# EAGLE design transponder (EAGLE 5.07)
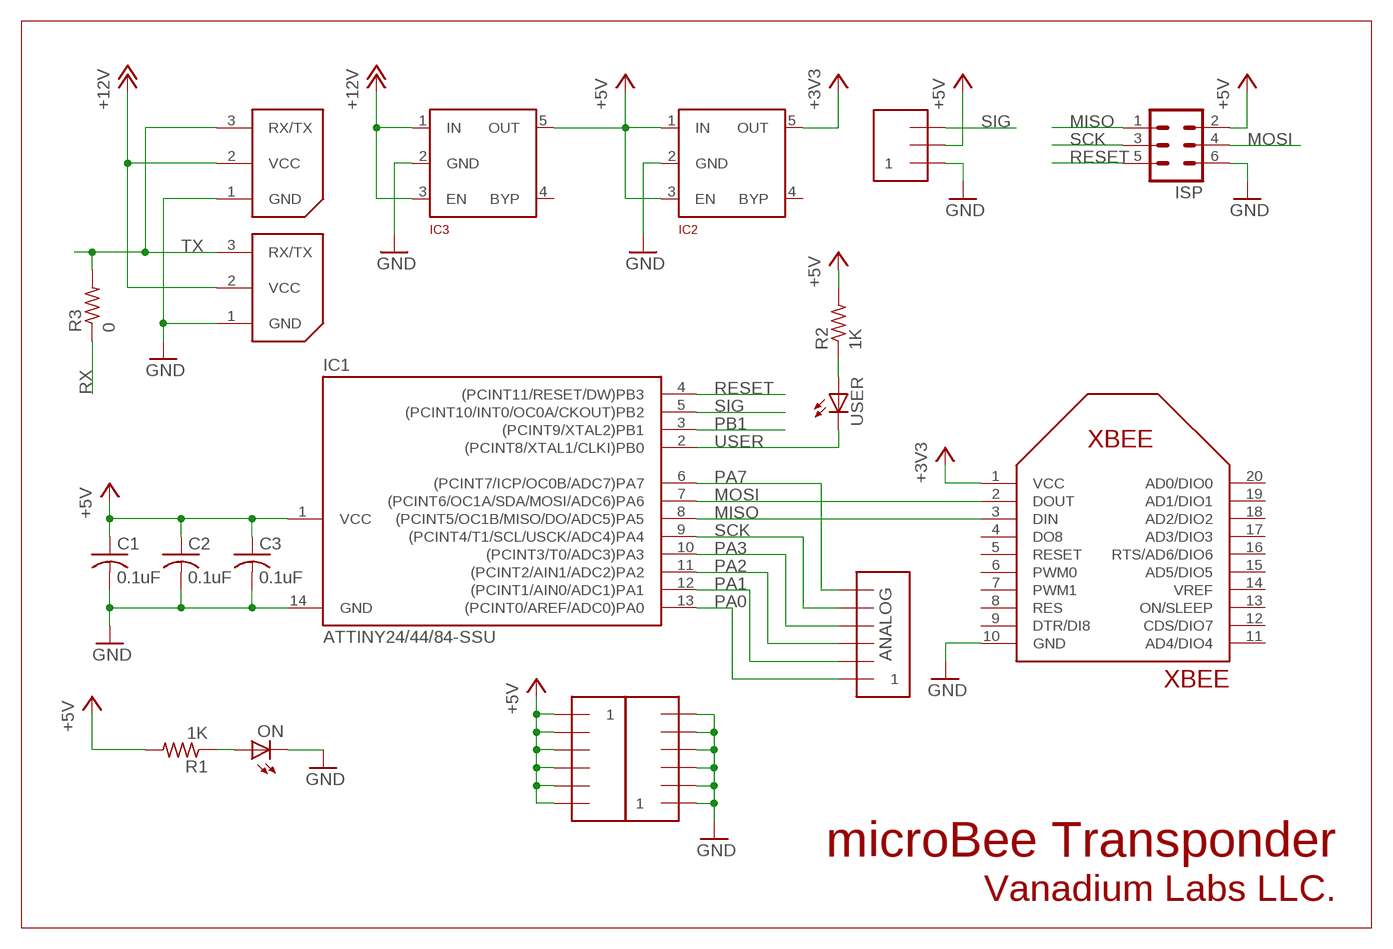
[diagram p0: schematic, sheet 1]

## Parts
C1  0.1uF  C-USC0603  [C0603]
C2  0.1uF  C-USC0603  [C0603]
C3  0.1uF  C-USC0603  [C0603]
IC1  ATTINY24/44/84-SSU  [SOIC14]
IC2  MIC5205-3.3  [SOT-23-5]
IC3  MIC5205-5.0  MIC5205-3.3  [SOT-23-5]
ISP  MA03-2  [MA03-2]
ON  LEDCHIPLED_0603  [CHIPLED_0603]
R1  1K  R-US_R0603  [R0603]
R2  1K  R-US_R0603  [R0603]
R3  0  R-US_R0603  [R0603]
U$1  AX-12  [WM18887-ND]
U$2  HEADER6  [1X6]
U$3  HEADER2X6  [2X6]
U$4  HEADER3  [1X3]
U$5  AX-12  [WM18887-ND]
USER  LEDCHIPLED_0603  [CHIPLED_0603]
XBEE  XBEE  [XBEE]

## Nets
+3V3: IC2.5(OUT) XBEE.1(VCC)
+5V: C1.1 C2.1 C3.1 IC1.1(VCC) IC2.1(IN) IC2.3(EN) IC3.5(OUT) ISP.2 R1.2 R2.2 U$3.P$7 U$3.P$8 U$3.P$9 U$3.P$10 U$3.P$11 U$3.P$12 U$4.P$2
+12V: IC3.1(IN) IC3.3(EN) U$1.2(VCC) U$5.2(VCC)
GND: C1.2 C2.2 C3.2 IC1.14(GND) IC2.2(GND) IC3.2(GND) ISP.6 ON.C U$1.1(GND) U$3.P$1 U$3.P$2 U$3.P$3 U$3.P$4 U$3.P$5 U$3.P$6 U$4.P$1 U$5.1(GND) XBEE.10(GND)
MISO: IC1.8((PCINT5/OC1B/MISO/DO/ADC5)PA5) ISP.1 R3.2 U$1.3(RX/TX) U$5.3(RX/TX) XBEE.3(DIN)
MOSI: IC1.7((PCINT6/OC1A/SDA/MOSI/ADC6)PA6) ISP.4 R3.1 XBEE.2(DOUT)
N$13: ON.A R1.1
N$14: R2.1 USER.A
PA0: IC1.13((PCINT0/AREF/ADC0)PA0) U$2.P$1
PA1: IC1.12((PCINT1/AIN0/ADC1)PA1) U$2.P$2
PA2: IC1.11((PCINT2/AIN1/ADC2)PA2) U$2.P$3
PA3: IC1.10((PCINT3/T0/ADC3)PA3) U$2.P$4
PA7: IC1.6((PCINT7/ICP/OC0B/ADC7)PA7) U$2.P$6
PB1: IC1.3((PCINT9/XTAL2)PB1)
RESET: IC1.4((PCINT11/RESET/DW)PB3) ISP.5
SCK: IC1.9((PCINT4/T1/SCL/USCK/ADC4)PA4) ISP.3 U$2.P$5
SIG: IC1.5((PCINT10/INT0/OC0A/CKOUT)PB2) U$4.P$3
USER: IC1.2((PCINT8/XTAL1/CLKI)PB0) USER.C
Unconnected: IC2.4(BYP) IC3.4(BYP) XBEE.4(DO8) XBEE.5(RESET) XBEE.6(PWM0) XBEE.7(PWM1) XBEE.8(RES) XBEE.9(DTR/DI8) XBEE.11(AD4/DIO4) XBEE.12(CDS/DIO7) XBEE.13(ON/SLEEP) XBEE.14(VREF) XBEE.15(AD5/DIO5) XBEE.16(RTS/AD6/DIO6) XBEE.17(AD3/DIO3) XBEE.18(AD2/DIO2) XBEE.19(AD1/DIO1) XBEE.20(AD0/DIO0)

## Notes on the sheet
- TX
- RX
- ANALOG
- microBee Transponder
- Vanadium Labs LLC.

## Library data of the parts
C1-C3 = rcl:C-US: CAPACITOR, American symbol
IC1 = attiny24_44_84:ATTINY24/44/84
IC2 IC3 = robots:MIC5205-3.3
ISP = con-lstb:MA03-2: PIN HEADER
ON USER = led:LED: LED OSRAM: - CHIPLED LG R971, LG N971, LY N971, LG Q971, LY Q971, LO R971, LY R971 LH N974, LH R974 LS Q976, LO Q976, LY Q976 LO Q996 - Hyper CHIPLED LW Q18S LB Q993, LB Q99A, LB R99A - SideLED LS A670, LO A670, LY A670, LG A670, LP A670 LB A673, LV A673, LT A673, LW A673 LH A674 LY A675 LS A676, LA A676, LO A676, LY A676, LW A676 LS A679, LY A679, LG A679 - Hyper Micro SIDELED® LS Y876, LA Y876, LO Y876, LY Y876 LT Y87S - SmartLED LW L88C, LW L88S LB L89C, LB L89S, LG L890 LS L89K, LO L89K, LY L89K LS L896, LA L896, LO L896, LY L896 - TOPLED LS T670, LO T670, LY T670, LG T670, LP T670 LSG T670, LSP T670, LSY T670, LOP T670, LYG T670 LG T671, LOG T671, LSG T671 LB T673, LV T673, LT T673, LW T673 LH T674 LS T676, LA T676, LO T676, LY T676, LB T676, LH T676, LSB T676, LW T676 LB T67C, LV T67C, LT T67C, LS T67K, LO T67K, LY T67K, LW E67C LS E67B, LA E67B, LO E67B, LY E67B, LB E67C, LV E67C, LT E67C LW T67C LS T679, LY T679, LG T679 LS T770, LO T770, LY T770, LG T770, LP T770 LB T773, LV T773, LT T773, LW T773 LH T774 LS E675, LA E675, LY E675, LS T675 LS T776, LA T776, LO T776, LY T776, LB T776 LHGB T686 LT T68C, LB T68C - Hyper Mini TOPLED® LB M676 - Mini TOPLED Santana® LG M470 LS M47K, LO M47K, LY M47K Source: http://www.osram.convergy.de LUXEON: - LUMILED® LXK2-PW12-R00, LXK2-PW12-S00, LXK2-PW14-U00, LXK2-PW14-V00 LXK2-PM12-R00, LXK2-PM12-S00, LXK2-PM14-U00 LXK2-PE12-Q00, LXK2-PE12-R00, LXK2-PE12-S00, LXK2-PE14-T00, LXK2-PE14-U00 LXK2-PB12-K00, LXK2-PB12-L00, LXK2-PB12-M00, LXK2-PB14-N00, LXK2-PB14-P00, LXK2-PB14-Q00 LXK2-PR12-L00, LXK2-PR12-M00, LXK2-PR14-Q00, LXK2-PR14-R00 LXK2-PD12-Q00, LXK2-PD12-R00, LXK2-PD12-S00 LXK2-PH12-R00, LXK2-PH12-S00 LXK2-PL12-P00, LXK2-PL12-Q00, LXK2-PL12-R00 Source: www.luxeon.com KINGBRIGHT: KA-3528ASYC Source: www.kingbright.com
R1-R3 = rcl:R-US_: RESISTOR, American symbol
U$1 U$5 = robots:AX-12
U$2 = robots:HEADER6
U$3 = robots:HEADER2X6
U$4 = robots:HEADER3
XBEE = robots:XBEE

## Board
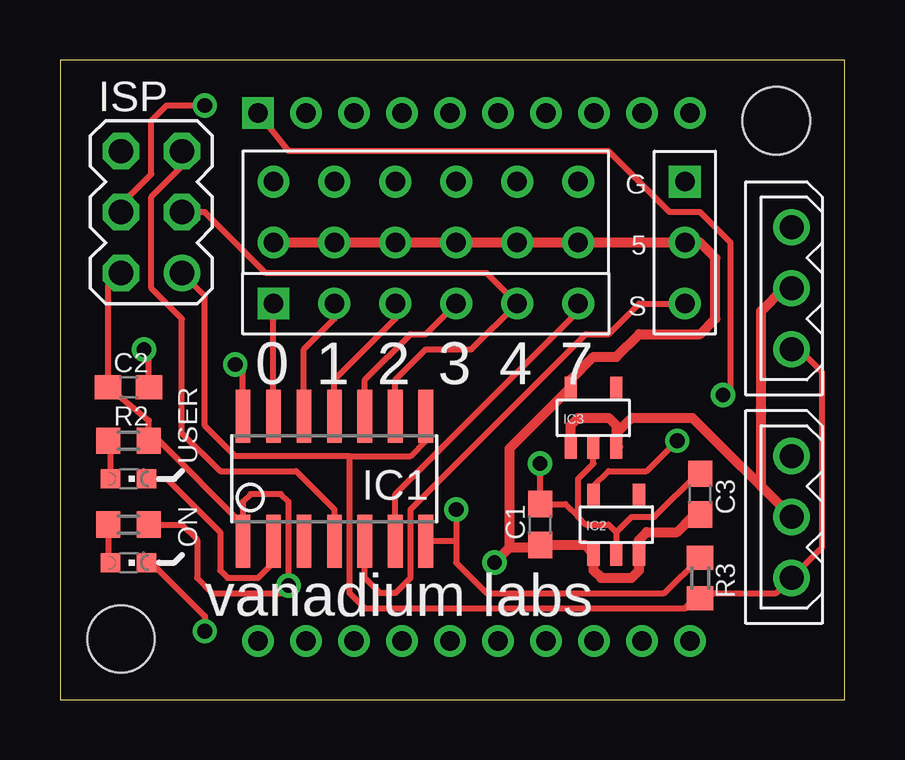
[diagram p1: board, top side]
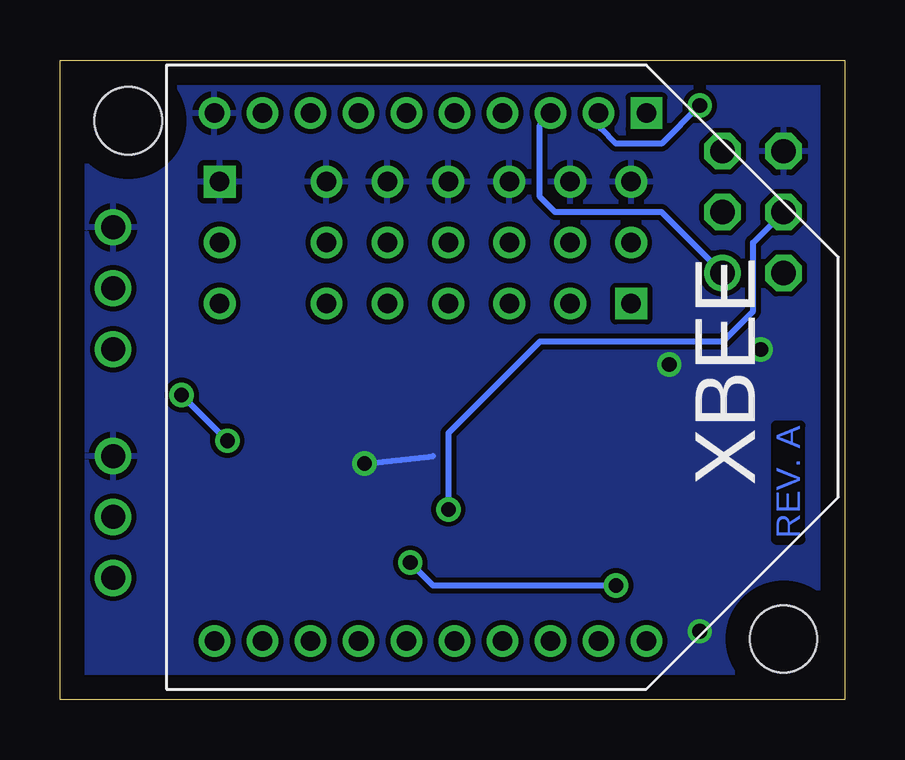
[diagram p2: board, bottom side, seen from below]

Size 32.69 x 26.66 mm. Coordinates in mm from the lower left corner, seen from the top.
Outline: 0,0 32.69,0 32.69,26.66 0,26.66 0,0
Copper layers (1*16): Top 0.035mm / dielectric 1.5mm / Bottom 0.035mm
Design rules "default *": minimum track width 10mil, minimum drill 24mil, track to track 8mil, track to pad 8mil, pad to pad 8mil, via to via 8mil, smd to smd 8mil, copper to edge 40mil, drill to drill 8mil, minimum pad ring 10mil, minimum via ring 8mil, stop-mask expansion 4mil, vias tented up to drill 24mil, thermal gap 10mil
Holes 2.8 mm at 2.54,2.54 29.84,24.13

### Footprints (pad centres in the part's own frame; a part is rotated, then mirrored left to right if it is on the bottom)
C0603 = smd 1.1 x 1: 1 -0.85,0; 2 0.85,0
SOIC14 = smd 0.61 x 2.21: 1 -3.81,-2.603; 2 -2.54,-2.603; 3 -1.27,-2.603; 4 0,-2.603; 5 1.27,-2.603; 6 2.54,-2.603; 7 3.81,-2.603; 8 3.81,2.603; 9 2.54,2.603; 10 1.27,2.603; 11 0,2.603; 12 -1.27,2.603; 13 -2.54,2.603; 14 -3.81,2.603
SOT-23-5 = smd 0.508 x 1.016: 1 -0.95,-1.2; 2 0,-1.2; 3 0.95,-1.2; 4 0.95,1.2; 5 -0.95,1.2
MA03-2 = drill 1.016 round: 1 -2.54,-1.27 | drill 1.016 octagon: 2 -2.54,1.27; 3 0,-1.27; 4 0,1.27; 5 2.54,-1.27; 6 2.54,1.27
CHIPLED_0603 = smd 0.8 x 0.8: A 0,-0.75; C 0,0.75
R0603 = smd 1 x 1.1: 1 -0.85,0; 2 0.85,0
WM18887-ND = drill 1 round: 1 0,0; 2 -2.54,0; 3 -5.08,0
1X6 = drill 0.813 square: P$1 0,0 | drill 0.813 round: P$2 2.54,0; P$3 5.08,0; P$4 7.62,0; P$5 10.16,0; P$6 12.7,0
2X6 = drill 0.813 round: P$1 0,0; P$2 2.54,0; P$3 5.08,0; P$4 7.62,0; P$5 10.16,0; P$6 12.7,0; P$7 0,2.54; P$8 2.54,2.54; P$9 5.08,2.54; P$10 7.62,2.54; P$11 10.16,2.54; P$12 12.7,2.54
1X3 = drill 0.813 square: P$1 0,0 | drill 0.813 round: P$2 2.54,0; P$3 5.08,0
XBEE = drill 0.813 square: 1 0,0 | drill 0.813 round: 2 0,-2; 3 0,-4; 4 0,-6; 5 0,-8; 6 0,-10; 7 0,-12; 8 0,-14; 9 0,-16; 10 0,-18; 11 22,-18; 12 22,-16; 13 22,-14; 14 22,-12; 15 22,-10; 16 22,-8; 17 22,-6; 18 22,-4; 19 22,-2; 20 22,0

### Placement (x,y rotation side)
C1  20,7.3 90 top
C2  2.86,13.02 0 top
C3  26.67,8.57 90 top
IC1  11.43,9.21 0 top
IC2  23.18,7.3 0 top
IC3  22.23,11.75 0 top
ISP  3.81,20.32 90 top
ON  2.86,5.71 270 top
R1  2.86,7.3 0 top
R2  2.86,10.79 0 top
R3  26.67,5.08 270 top
U$1  30.48,19.68 90 top
U$2  8.89,16.51 0 top
U$3  21.59,21.59 180 top
U$4  26.04,21.59 270 top
U$5  30.48,10.16 90 top
USER  2.86,9.21 270 top
XBEE  8.26,24.45 270 bottom

### Tracks (layer width: path | path; a pad name or v marks a point on that pad's centre or on a via)
+3V3  (via drill 0.61)
  Top 0.254: XBEE.1 9.53,22.86 22.86,22.86 25.4,20.32 26.67,20.32 27.94,19.05 27.94,13.02 v27.62,12.7 | IC2.5 22.23,8.89 22.86,9.53 24.45,9.53 v25.72,10.79
  Bottom 0.254: v25.72,10.79 v27.62,12.7
+5V  (via drill 0.61)
  Top 0.254: ISP.2 2.01,17.25 C2.1 3.71,11.63 R2.2 4.13,10.79 7.62,7.3 | 7.62,7.3 7.62,8.26 7.94,8.57 9.21,8.57 9.53,8.26 v9.53,4.76 9.21,4.45 6.35,4.45 5.71,5.08 5.71,6.67 5.08,7.3 R1.2 | 7.62,7.3 IC1.1 | 24.13,6.13 24.16,6.13 IC2.3 | 19.9,6.35 C1.1 | 21.2,12.95 IC3.5
  Top 0.406: U$3.P$12 U$3.P$11 U$3.P$10 U$3.P$9 U$3.P$8 U$3.P$7 U$4.P$2 26.67,19.05 27.3,18.41 27.3,15.88 26.67,15.24 24.13,15.24 23.18,14.29 22.23,14.29 21.27,13.34 IC3.5 | IC2.3 24.13,5.78 24.13,5.4 23.81,5.08 22.54,5.08 22.23,5.39 IC2.1 21.88,6.45 C1.1 | 24.13,6.13 24.13,6.67 24.45,6.99 25.72,6.99 26.35,7.62 26.67,7.62 C3.1 | v18.1,5.71 18.73,6.35 | 18.73,6.35 19.9,6.35 | 21.2,12.95 18.73,10.48 18.73,6.35
  Bottom 0.254: v9.53,4.76 17.14,4.76 v18.1,5.71
+12V
  Top 0.254: 23.25,10.54 23.25,10.48 IC3.3 23.18,10.48
  Top 0.406: 23.25,10.54 23.25,11.18 23.81,11.75 26.35,11.75 U$5.2 29.21,8.89 29.21,16.19 30.16,17.14 U$1.2 | IC3.1 21.27,11.43 21.59,11.75 22.86,11.75 23.18,11.43 IC3.3
GND  (via drill 0.61)
  Top 0.254: 23.18,6.99 22.86,7.3 21.91,7.3 21.59,7.62 | 23.18,6.99 IC2.2 | 21.59,7.62 21.06,8.15 C1.2 v20,9.84 | IC1.14 7.62,13.65 v7.3,13.97 | IC3.2 22.23,9.84 21.59,9.21 21.59,7.62 | C3.2 26.57,9.42 24.77,7.62 23.81,7.62 23.18,6.99 | C2.2 3.71,14.39 v3.49,14.61 | ON.C 3.81,5.71 6.03,3.49 v6.03,2.86
  Bottom 0.254: v20,9.84 17.14,10.16 | v6.03,2.86 6.03,3.17
  pour Bottom: 0.95,25.72 31.75,25.72 31.75,0.95 0.95,0.95
MISO
  Top 0.254: ISP.1 6.03,16.83 6.03,11.43 7.3,10.16 12.06,10.16 | 12.06,10.16 12.06,4.45 12.7,3.81 26.04,3.81 26.45,4.23 R3.2 26.89,4.45 29.84,4.45 U$5.3 31.75,6.35 31.75,13.65 30.8,14.61 U$1.3 | 12.06,10.16 14.61,10.16 15.24,10.79 IC1.8
  Bottom 0.254: ISP.1 7.62,20.32 12.06,20.32 12.7,20.95 12.7,23.94 XBEE.3
MOSI  (via drill 0.61)
  Top 0.254: ISP.4 2.54,20.64 3.81,21.91 3.81,24.13 4.45,24.77 v6.03,24.77 | R3.1 25.18,4.45 17.78,4.45 16.51,5.71 16.51,6.67 | v16.51,7.94 16.51,6.67 | IC1.7 16.45,6.6 16.51,6.67
  Bottom 0.254: v16.51,7.94 16.51,11.11 12.7,14.92 5.08,14.92 3.81,16.19 3.81,19.05 ISP.4 | v6.03,24.77 7.62,23.18 9.53,23.18 10.16,23.81 10.16,24.23 10.26,24.32 XBEE.2
N$13
  Top 0.254: R1.1 2.01,5.82 ON.A
N$14
  Top 0.254: USER.A 2.11,10.38 R2.1
PA0
  Top 0.254: IC1.13 U$2.P$1
PA1
  Top 0.254: IC1.12 10.16,14.61 11.43,15.88 U$2.P$2
PA2
  Top 0.254: IC1.11 11.43,13.34 13.97,15.88 U$2.P$3
PA3
  Top 0.254: U$2.P$4 15.24,15.24 14.61,15.24 12.7,13.34 IC1.10
PA7
  Top 0.254: IC1.6 13.97,8.57 21.59,16.19 U$2.P$6
RESET
  Top 0.254: IC1.4 11.43,7.94 9.84,9.53 6.67,9.53 5.08,11.11 5.08,15.88 3.81,17.14 3.81,20.95 5.08,22.23 ISP.5
SCK
  Top 0.254: IC1.9 13.97,13.34 15.24,14.61 17.14,14.61 U$2.P$5 17.78,17.78 8.57,17.78 6.03,20.32 ISP.3
SIG
  Top 0.254: IC1.5 12.7,5.08 13.34,4.45 13.97,4.45 14.61,5.08 14.61,7.94 21.91,15.24 22.86,15.24 24.13,16.51 U$4.P$3
USER
  Top 0.254: USER.C 4.45,9.21 6.67,6.99 6.67,5.4 6.99,5.08 8.26,5.08 8.89,5.71 IC1.2

### Text on the board
Bottom: REV. A
tPlace: vanadium labs
tNames: G | 5 | S | 0 | 1 | 2 | 3 | 4 | 7 | ON